# Altium schematic sheet ChargePreAmplifer.SchDoc
size A4
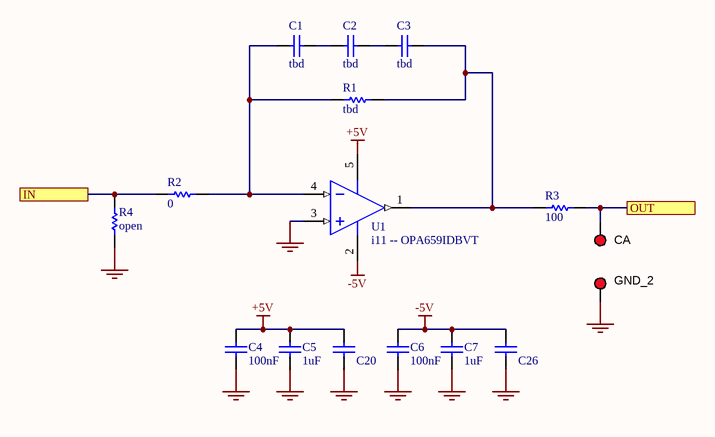
[diagram p0: ChargePreAmplifer.SchDoc]

## Parts
C1  tbd  [CAPC0603(1608)100_N]
C2  tbd  [CAPC0603(1608)100_N]
C3  tbd  [CAPC0603(1608)100_N]
C4  100nF  [CAPC0603(1608)100_N]
C5  1uF  [CAPC0603(1608)100_N]
C6  100nF  [CAPC0603(1608)100_N]
C7  1uF  [CAPC0603(1608)100_N]
C20  10uF X7R 10V 0805  [CAPC0805(2012)145_N]  (value not drawn)
C26  10uF X7R 10V 0805  [CAPC0805(2012)145_N]  (value not drawn)
CA  5010  [KSTN-5010_V]  (value not drawn)
GND_2  5010  [KSTN-5010_V]  (value not drawn)
R1  tbd  [RESC0603(1608)_N]
R2  0  [RESC0603(1608)_N]
R3  100  [RESC0603(1608)_L]
R4  open  [RESC0603(1608)_N]
U1  i11 -- OPA659IDBVT  [TI-DBV5_L]

## Ports
IN, OUT

## Nets
+5V: C4.2 C5.2 C20.2 U1.5(VS+)
-5V: C6.2 C7.2 C26.2 U1.2(VS-)
GND: C4.1 C5.1 C6.1 C7.1 C20.1 C26.1 GND_2.1 R4.1 U1.3(IN+)
IN: R2.1 R4.2 ; port IN
OUT: CA.1 R3.2 ; port OUT
NetC1_1: C1.1 C2.2
NetC1_2: C1.2 R1.1 R2.2 U1.4(IN-)
NetC2_1: C2.1 C3.2
NetC3_1: C3.1 R1.2 R3.1 U1.1(OUT)

## Library data of the parts
C1-C3 C5 C7 = CMP-1035-02589-1: CAP 1uF 25V ±20% 0603 (1608 Metric) Thickness 1mm SMD; Value: 100nF; Case-EIA: 0603; Tolerance: Â±20%; Case-Metric: 1608; Max Thickness: 1 mm; Technology: SMT; Rated Voltage: 25 V
C4 C6 = CMP-1035-02589-1: CAP 100nF 25V ±20% 0603 (1608 Metric) Thickness 1mm SMD; Case-EIA: 0603; Tolerance: Â±20%; Case-Metric: 1608; Value: 100nF; Max Thickness: 1 mm; Technology: SMT; Rated Voltage: 25 V
C20 C26 = CMP-1036-04932-1: Case-EIA: 0805; Case-Metric: 2012; Rated Voltage: 25 V; Tolerance: Â±10%; Technology: SMT; Value: 10uF; Max Thickness: 1.45 mm
CA GND_2 = CMP-1672-00002-3: Test Point, Red, Through Hole, RoHS, Bulk; REACH SVHC: No SVHC; Contact Material: Bronze; PackageDescription: 1-Pin Through Hole Device, Dia 3.17 mm; Mounting Technology: Through Hole; Colour: Red; PackageReference: 5010; Height: 8.12 mm; Pins: 1; RoHSCompliant: true; Package Quantity: 100; Packaging: Bulk; Mount: Through Hole; DatasheetVersion: Rev. F, 12/2013; Contact Plating: Silver
R1-R4 = CMP-1012-00397-1: 100R 0.1W 1% 0603 (1608 Metric)  SMD; Value: 100.00 Ohm; Case-EIA: 0603; Case-Metric: 1608; Technology: SMT; Tolerance: 1 %; Power: 0.1 W
U1 = CMP-0018-00409-1: 650 MHz Unity Gain Stable JFET Input Amplifier, 7 to 13 V, -40 to 85 degC, 5-pin SOT23 (DBV5), Green (RoHS & no Sb/Br); Manufacturer: Texas Instruments; Number of Channels: 1; THD (Fc is 1 MHz)(Typ)(dB): -78; BW @ Acl(MHz): 650; Slew Rate(Typ)(V/us): 2550; Vs(Max)(V): 13; 3rd Harmonic(dBc): 100; Sub Family: High Output Current Amplifier (>=50mA), High Speed Amplifier (>=50MHz); Vn at Flatband(Typ)(nV/rtHz): 8.9; 2nd Harmonic(dBc): 79; Vio(Max)(mV): 5; Vs(Min)(V): 7; Acl, min stable gain(V/V): 2; Io(Typ)(mA): 70; @ MHz: 10; Iq per channel(Max)(mA): 33.5; Iib(Max)(nA): 1.2; Code_JEDEC: MO-178; ComponentLink1Description: Manufacturer URL; ComponentLink3Description: Package Specification; PackageReference: DBV5; PackageVersion: 4073253-4/K, 03/2006; ComponentLink3URL: http://www.ti.com/litv/pdf/mpds018i; ComponentLink2Description: Datasheet; Mounting Technology: Surface Mount; PackageDescription: 5-Pin Plastic Small Outline, Body 1.6 x 2.9 mm, Pitch 0.95 mm; PartNumber: OPA659IDBVT; DatasheetVersion: SBOS342B; ComponentLink1URL: http://www.ti.com/; Eco-Plan: Green (RoHS & no Sb/Br); ComponentLink2URL: http://www.ti.com/general/docs/lit/getliterature.tsp?genericPartNumber=OPA659&fileType=pdf